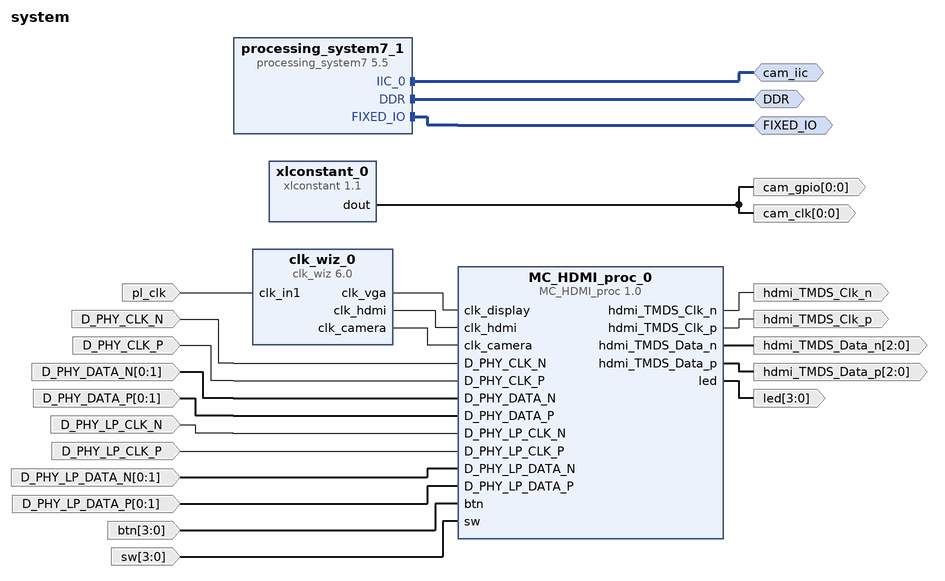
[diagram p0: block diagram of the top level]
# Vivado block design system, xc7z020clg400-1, Vivado 2020.2
create_bd_design system

create_bd_intf_port -mode Master -vlnv xilinx.com:interface:ddrx_rtl:1.0 DDR
create_bd_intf_port -mode Master -vlnv xilinx.com:display_processing_system7:fixedio_rtl:1.0 FIXED_IO
create_bd_intf_port -mode Master -vlnv xilinx.com:interface:iic_rtl:1.0 cam_iic
create_bd_port -dir I -type clk pl_clk
set_property -dict {CONFIG.FREQ_HZ 125000000} [get_bd_ports pl_clk]
create_bd_port -dir I -type clk D_PHY_CLK_N
create_bd_port -dir I -type clk D_PHY_CLK_P
create_bd_port -dir I -from 0 -to 1 D_PHY_DATA_N
create_bd_port -dir I -from 0 -to 1 D_PHY_DATA_P
create_bd_port -dir I -type clk D_PHY_LP_CLK_N
create_bd_port -dir I -type clk D_PHY_LP_CLK_P
create_bd_port -dir I -from 0 -to 1 D_PHY_LP_DATA_N
create_bd_port -dir I -from 0 -to 1 D_PHY_LP_DATA_P
create_bd_port -dir O -from 3 -to 0 led
create_bd_port -dir O -type clk hdmi_TMDS_Clk_p
create_bd_port -dir O -type clk hdmi_TMDS_Clk_n
create_bd_port -dir O -from 2 -to 0 hdmi_TMDS_Data_p
create_bd_port -dir O -from 2 -to 0 hdmi_TMDS_Data_n
create_bd_port -dir I -from 3 -to 0 btn
create_bd_port -dir I -from 3 -to 0 sw
create_bd_port -dir O -from 0 -to 0 -type data cam_clk
create_bd_port -dir O -from 0 -to 0 -type data cam_gpio

create_bd_cell -type ip -vlnv xilinx.com:ip:clk_wiz:6.0 clk_wiz_0
set_property -dict [list \
  CONFIG.CLKIN1_JITTER_PS 80.0 \
  CONFIG.CLKOUT1_JITTER 173.196 \
  CONFIG.CLKOUT1_PHASE_ERROR 104.065 \
  CONFIG.CLKOUT1_REQUESTED_OUT_FREQ 25.000 \
  CONFIG.CLKOUT2_JITTER 125.031 \
  CONFIG.CLKOUT2_PHASE_ERROR 104.065 \
  CONFIG.CLKOUT2_REQUESTED_OUT_FREQ 125.000 \
  CONFIG.CLKOUT2_USED true \
  CONFIG.CLKOUT3_JITTER 117.310 \
  CONFIG.CLKOUT3_PHASE_ERROR 104.065 \
  CONFIG.CLKOUT3_REQUESTED_OUT_FREQ 180.000 \
  CONFIG.CLKOUT3_USED true \
  CONFIG.CLK_IN1_BOARD_INTERFACE sys_clock \
  CONFIG.CLK_OUT1_PORT clk_vga \
  CONFIG.CLK_OUT2_PORT clk_hdmi \
  CONFIG.CLK_OUT3_PORT clk_camera \
  CONFIG.MMCM_CLKFBOUT_MULT_F 7.000 \
  CONFIG.MMCM_CLKIN1_PERIOD 8.000 \
  CONFIG.MMCM_CLKOUT0_DIVIDE_F 35.000 \
  CONFIG.MMCM_CLKOUT1_DIVIDE 7 \
  CONFIG.MMCM_CLKOUT2_DIVIDE 5 \
  CONFIG.MMCM_DIVCLK_DIVIDE 1 \
  CONFIG.NUM_OUT_CLKS 3 \
  CONFIG.PRIM_IN_FREQ 125.000 \
  CONFIG.USE_LOCKED false \
  CONFIG.USE_RESET false \
] [get_bd_cells clk_wiz_0]
create_bd_cell -type ip -vlnv xilinx.com:ip:processing_system7:5.5 processing_system7_1
set_property -dict [list \
  CONFIG.PCW_APU_PERIPHERAL_FREQMHZ 667 \
  CONFIG.PCW_ENET0_PERIPHERAL_ENABLE 0 \
  CONFIG.PCW_FPGA0_PERIPHERAL_FREQMHZ 100 \
  CONFIG.PCW_FPGA1_PERIPHERAL_FREQMHZ 200 \
  CONFIG.PCW_GP0_EN_MODIFIABLE_TXN 0 \
  CONFIG.PCW_GP1_EN_MODIFIABLE_TXN 0 \
  CONFIG.PCW_GPIO_MIO_GPIO_ENABLE 0 \
  CONFIG.PCW_I2C0_I2C0_IO EMIO \
  CONFIG.PCW_I2C0_PERIPHERAL_ENABLE 1 \
  CONFIG.PCW_I2C_PERIPHERAL_FREQMHZ 111.111115 \
  CONFIG.PCW_PERIPHERAL_BOARD_PRESET part0 \
  CONFIG.PCW_PRESET_BANK1_VOLTAGE {LVCMOS 1.8V} \
  CONFIG.PCW_QSPI_PERIPHERAL_ENABLE 0 \
  CONFIG.PCW_SD0_PERIPHERAL_ENABLE 0 \
  CONFIG.PCW_UART1_PERIPHERAL_ENABLE 1 \
  CONFIG.PCW_UART1_UART1_IO {MIO 48 .. 49} \
  CONFIG.PCW_UART_PERIPHERAL_FREQMHZ 100 \
  CONFIG.PCW_UIPARAM_DDR_FREQ_MHZ 533.333333 \
  CONFIG.PCW_UIPARAM_DDR_MEMORY_TYPE {DDR 3 (Low Voltage)} \
  CONFIG.PCW_UIPARAM_DDR_PARTNO {MT41K256M16 RE-125} \
  CONFIG.PCW_USB0_PERIPHERAL_ENABLE 0 \
  CONFIG.PCW_USE_M_AXI_GP0 0 \
] [get_bd_cells processing_system7_1]
# 333 more settings of processing_system7_1 are not shown: defaults, MIO pin electricals, DDR timing, and values the tool derives
create_bd_cell -type ip -vlnv xilinx.com:ip:xlconstant:1.1 xlconstant_0
create_bd_cell -type ip -vlnv cime3:user:MC_HDMI_proc:1.0 MC_HDMI_proc_0

# ---- connections ----

connect_bd_intf_net [get_bd_intf_ports DDR] [get_bd_intf_pins processing_system7_1/DDR]
connect_bd_intf_net [get_bd_intf_ports cam_iic] [get_bd_intf_pins processing_system7_1/IIC_0]
connect_bd_intf_net [get_bd_intf_ports FIXED_IO] [get_bd_intf_pins processing_system7_1/FIXED_IO]
connect_bd_net -net clk_in1_1 [get_bd_ports pl_clk] [get_bd_pins clk_wiz_0/clk_in1]
connect_bd_net [get_bd_pins clk_wiz_0/clk_vga] [get_bd_pins MC_HDMI_proc_0/clk_display]
connect_bd_net [get_bd_pins clk_wiz_0/clk_hdmi] [get_bd_pins MC_HDMI_proc_0/clk_hdmi]
connect_bd_net [get_bd_pins clk_wiz_0/clk_camera] [get_bd_pins MC_HDMI_proc_0/clk_camera]
connect_bd_net [get_bd_ports D_PHY_CLK_N] [get_bd_pins MC_HDMI_proc_0/D_PHY_CLK_N]
connect_bd_net [get_bd_ports D_PHY_CLK_P] [get_bd_pins MC_HDMI_proc_0/D_PHY_CLK_P]
connect_bd_net [get_bd_ports D_PHY_DATA_N] [get_bd_pins MC_HDMI_proc_0/D_PHY_DATA_N]
connect_bd_net [get_bd_ports D_PHY_DATA_P] [get_bd_pins MC_HDMI_proc_0/D_PHY_DATA_P]
connect_bd_net [get_bd_ports D_PHY_LP_CLK_N] [get_bd_pins MC_HDMI_proc_0/D_PHY_LP_CLK_N]
connect_bd_net [get_bd_ports D_PHY_LP_CLK_P] [get_bd_pins MC_HDMI_proc_0/D_PHY_LP_CLK_P]
connect_bd_net [get_bd_ports D_PHY_LP_DATA_N] [get_bd_pins MC_HDMI_proc_0/D_PHY_LP_DATA_N]
connect_bd_net [get_bd_ports D_PHY_LP_DATA_P] [get_bd_pins MC_HDMI_proc_0/D_PHY_LP_DATA_P]
connect_bd_net [get_bd_pins MC_HDMI_proc_0/led] [get_bd_ports led]
connect_bd_net [get_bd_pins MC_HDMI_proc_0/hdmi_TMDS_Clk_p] [get_bd_ports hdmi_TMDS_Clk_p]
connect_bd_net [get_bd_pins MC_HDMI_proc_0/hdmi_TMDS_Clk_n] [get_bd_ports hdmi_TMDS_Clk_n]
connect_bd_net [get_bd_pins MC_HDMI_proc_0/hdmi_TMDS_Data_p] [get_bd_ports hdmi_TMDS_Data_p]
connect_bd_net [get_bd_pins MC_HDMI_proc_0/hdmi_TMDS_Data_n] [get_bd_ports hdmi_TMDS_Data_n]
connect_bd_net [get_bd_ports btn] [get_bd_pins MC_HDMI_proc_0/btn]
connect_bd_net [get_bd_ports sw] [get_bd_pins MC_HDMI_proc_0/sw]
connect_bd_net [get_bd_pins xlconstant_0/dout] [get_bd_ports cam_gpio] [get_bd_ports cam_clk]

validate_bd_design
save_bd_design
